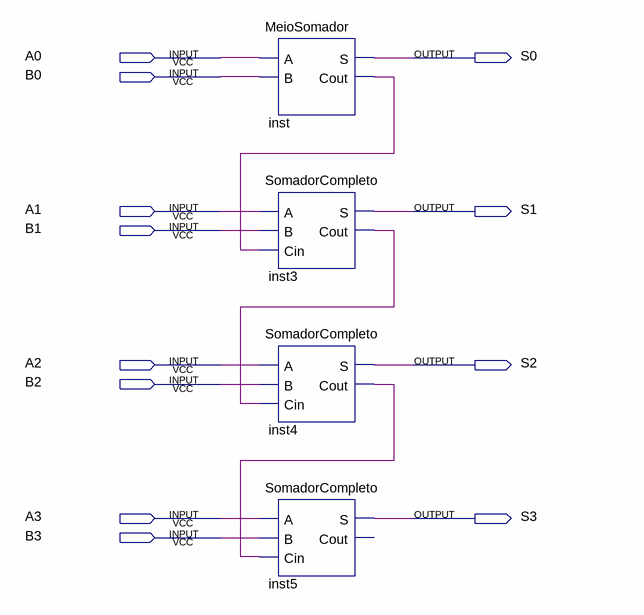
[diagram p0: schematic sheet]
// Quartus schematic Somador4Bits.bdf as structural Verilog: 4 symbols, 12 pins
module Somador4Bits (
  input  A0,
  input  B0,
  input  A1,
  input  B1,
  input  A2,
  input  B2,
  input  A3,
  input  B3,
  output S0,
  output S1,
  output S2,
  output S3
);

  wire inst3_cout, inst4_cout, inst_cout;

  MeioSomador inst (.A(A0), .B(B0), .S(S0), .Cout(inst_cout));
  SomadorCompleto inst3 (.A(A1), .B(B1), .Cin(inst_cout), .S(S1), .Cout(inst3_cout));
  SomadorCompleto inst4 (.A(A2), .B(B2), .Cin(inst3_cout), .S(S2), .Cout(inst4_cout));
  SomadorCompleto inst5 (.A(A3), .B(B3), .Cin(inst4_cout), .S(S3));  // open: Cout
endmodule
